# Altium schematic sheet KeyBoard-RP2040_P2.SchDoc
size A3; SheetNumber: 2; SheetTotal: 2
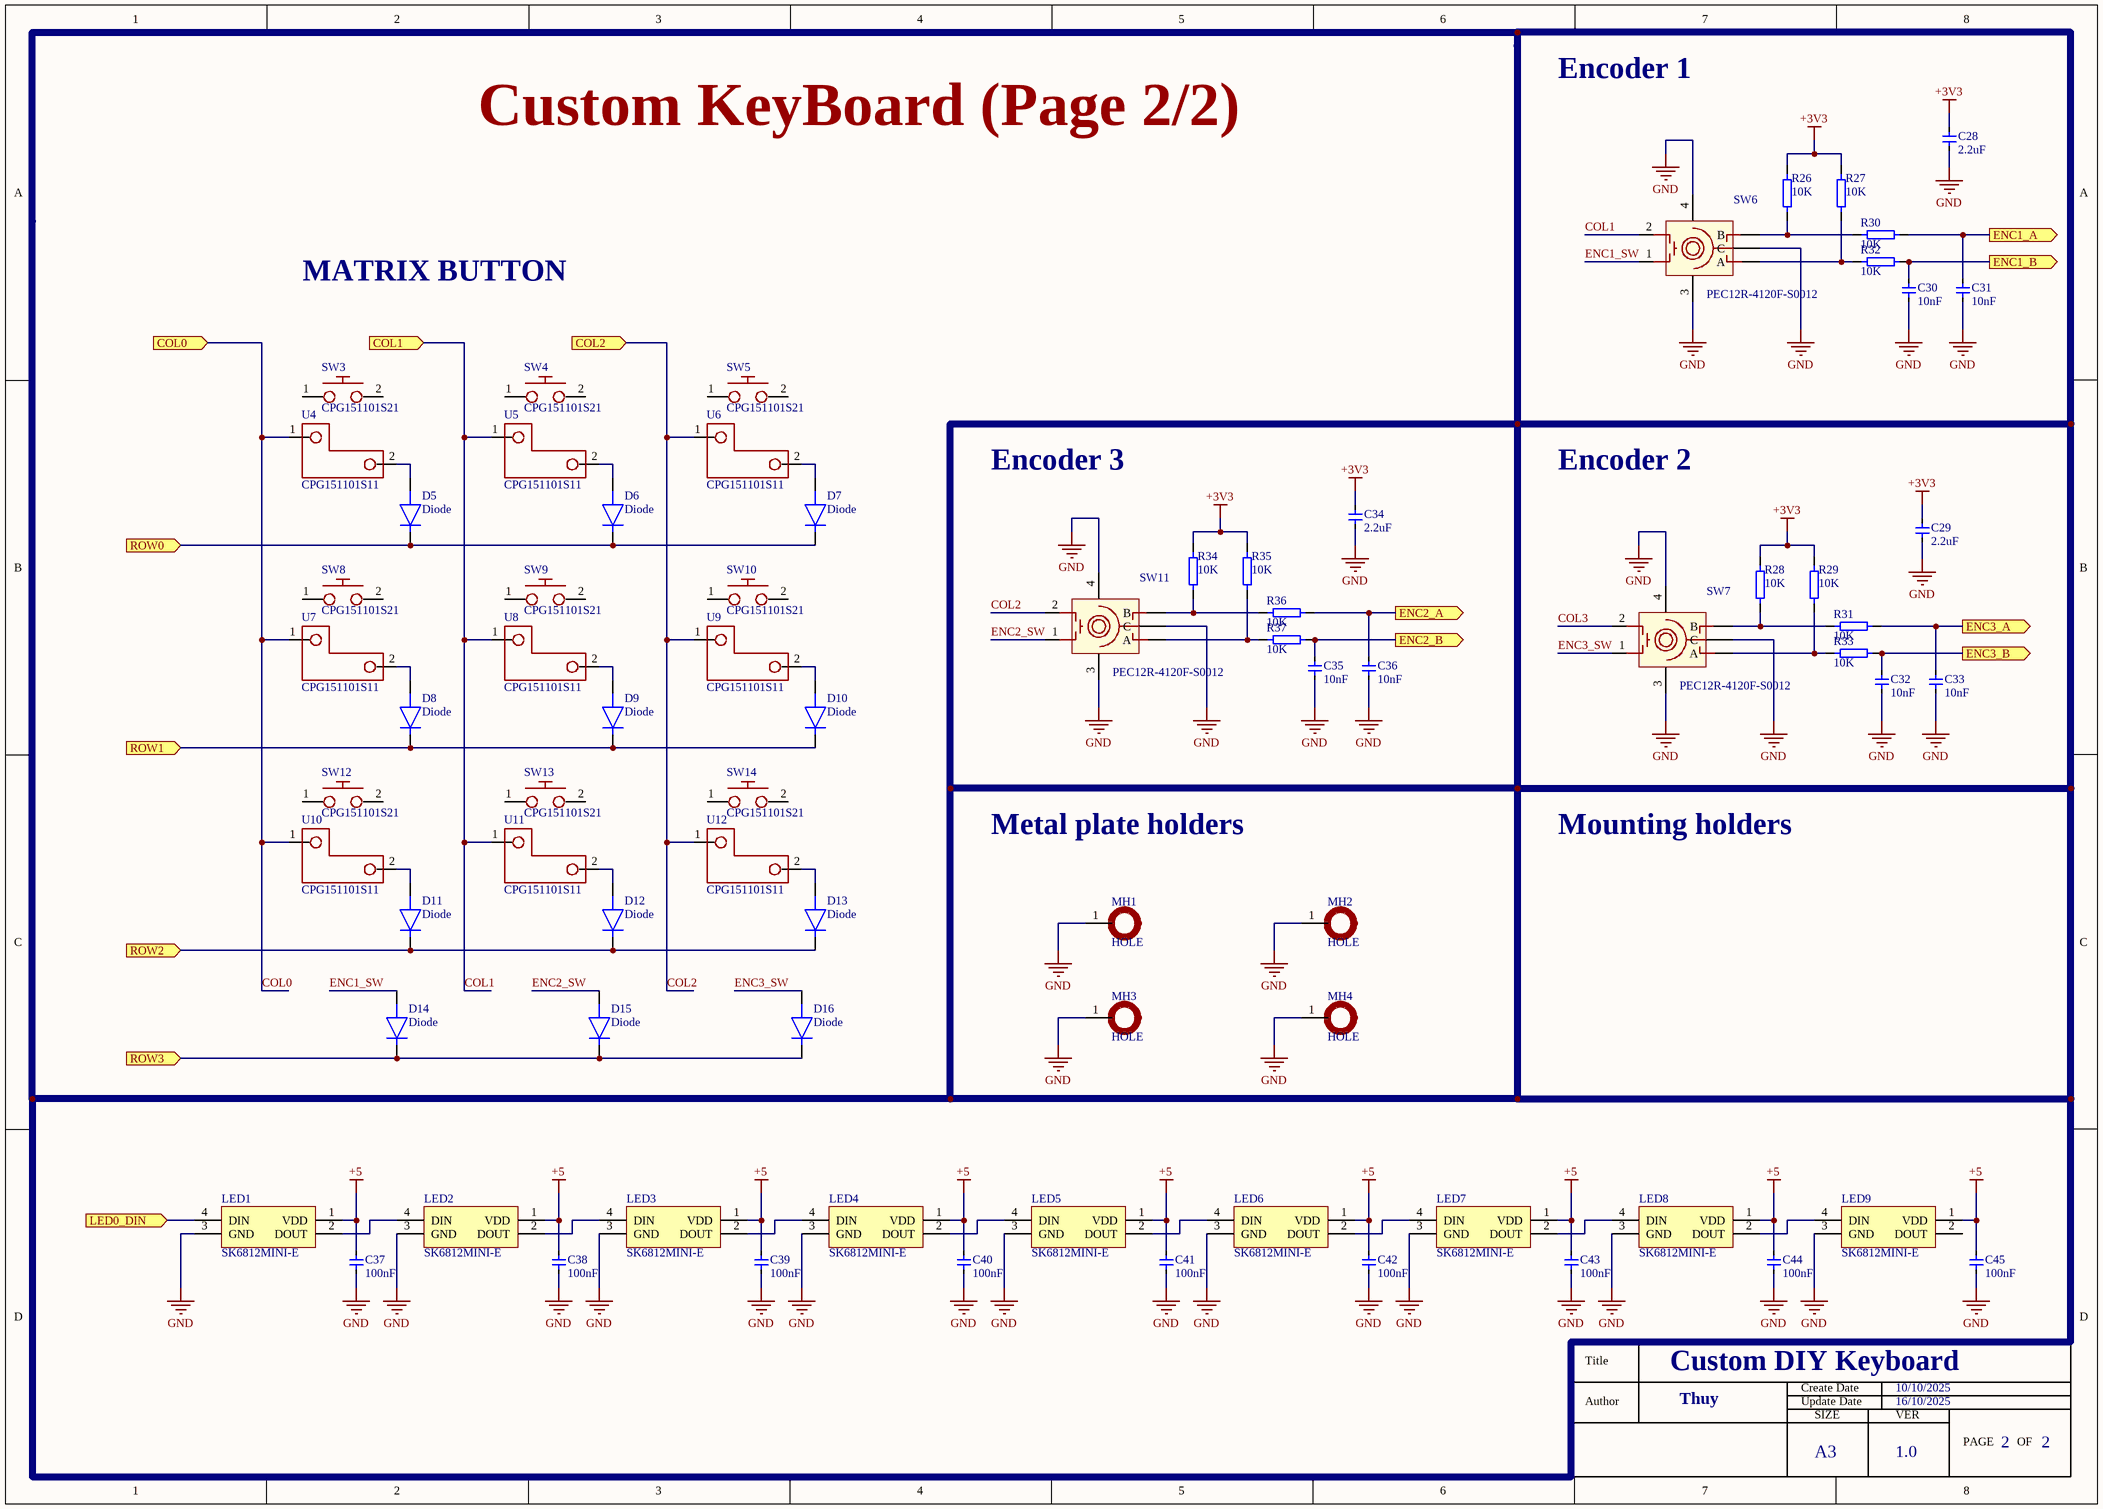
[diagram p0: KeyBoard-RP2040_P2.SchDoc]

## Parts
C28  2.2uF  [C 0.79 0.54]
C29  2.2uF  [C 0.79 0.54]
C30  10nF  [SMD 0.79 0.54]
C31  10nF  [SMD 0.79 0.54]
C32  10nF  [SMD 0.79 0.54]
C33  10nF  [SMD 0.79 0.54]
C34  2.2uF  [C 0.79 0.54]
C35  10nF  [SMD 0.79 0.54]
C36  10nF  [SMD 0.79 0.54]
C37  100nF  [C 0.79 0.54]
C38  100nF  [C 0.79 0.54]
C39  100nF  [C 0.79 0.54]
C40  100nF  [C 0.79 0.54]
C41  100nF  [C 0.79 0.54]
C42  100nF  [C 0.79 0.54]
C43  100nF  [C 0.79 0.54]
C44  100nF  [C 0.79 0.54]
C45  100nF  [C 0.79 0.54]
D5  Diode  [Diode]
D6  Diode  [Diode]
D7  Diode  [Diode]
D8  Diode  [Diode]
D9  Diode  [Diode]
D10  Diode  [Diode]
D11  Diode  [Diode]
D12  Diode  [Diode]
D13  Diode  [Diode]
D14  Diode  [Diode]
D15  Diode  [Diode]
D16  Diode  [Diode]
LED1  SK6812MINI-E  [LED-SK6812MINI-E]
LED2  SK6812MINI-E  [LED-SK6812MINI-E]
LED3  SK6812MINI-E  [LED-SK6812MINI-E]
LED4  SK6812MINI-E  [LED-SK6812MINI-E]
LED5  SK6812MINI-E  [LED-SK6812MINI-E]
LED6  SK6812MINI-E  [LED-SK6812MINI-E]
LED7  SK6812MINI-E  [LED-SK6812MINI-E]
LED8  SK6812MINI-E  [LED-SK6812MINI-E]
LED9  SK6812MINI-E  [LED-SK6812MINI-E]
MH1  HOLE  [Hole]
MH2  HOLE  [Hole]
MH3  HOLE  [Hole]
MH4  HOLE  [Hole]
R26  10K  [SMD 0.566 0.54]
R27  10K  [SMD 0.566 0.54]
R28  10K  [SMD 0.566 0.54]
R29  10K  [SMD 0.566 0.54]
R30  10K  [SMD 0.566 0.54]
R31  10K  [SMD 0.566 0.54]
R32  10K  [SMD 0.566 0.54]
R33  10K  [SMD 0.566 0.54]
R34  10K  [SMD 0.566 0.54]
R35  10K  [SMD 0.566 0.54]
R36  10K  [SMD 0.566 0.54]
R37  10K  [SMD 0.566 0.54]
SW3  CPG151101S21  [CPG151101S21]
SW4  CPG151101S21  [CPG151101S21]
SW5  CPG151101S21  [CPG151101S21]
SW6  PEC12R-4120F-S0012  [SW-encoder]
SW7  PEC12R-4120F-S0012  [SW-encoder]
SW8  CPG151101S21  [CPG151101S21]
SW9  CPG151101S21  [CPG151101S21]
SW10  CPG151101S21  [CPG151101S21]
SW11  PEC12R-4120F-S0012  [SW-encoder]
SW12  CPG151101S21  [CPG151101S21]
SW13  CPG151101S21  [CPG151101S21]
SW14  CPG151101S21  [CPG151101S21]
U4  CPG151101S11  [CPG151101S11]
U5  CPG151101S11  [CPG151101S11]
U6  CPG151101S11  [CPG151101S11]
U7  CPG151101S11  [CPG151101S11]
U8  CPG151101S11  [CPG151101S11]
U9  CPG151101S11  [CPG151101S11]
U10  CPG151101S11  [CPG151101S11]
U11  CPG151101S11  [CPG151101S11]
U12  CPG151101S11  [CPG151101S11]

## Ports
COL0 (in), COL1 (in), COL2 (in), ENC1_A (out), ENC1_B (out), ENC2_A (out), ENC2_B (out), ENC3_A (out), ENC3_B (out), LED0_DIN (in), ROW0 (in), ROW1 (in), ROW2 (in), ROW3 (in)

## Nets
+3V3: C28.2 C29.2 C34.2 R26.2 R27.2 R28.2 R29.2 R34.2 R35.2
+5: C37.2 C38.2 C39.2 C40.2 C41.2 C42.2 C43.2 C44.2 C45.2 LED1.1(VDD) LED2.1(VDD) LED3.1(VDD) LED4.1(VDD) LED5.1(VDD) LED6.1(VDD) LED7.1(VDD) LED8.1(VDD) LED9.1(VDD)
GND: C28.1 C29.1 C30.1 C31.1 C32.1 C33.1 C34.1 C35.1 C36.1 C37.1 C38.1 C39.1 C40.1 C41.1 C42.1 C43.1 C44.1 C45.1 LED1.3(GND) LED2.3(GND) LED3.3(GND) LED4.3(GND) LED5.3(GND) LED6.3(GND) LED7.3(GND) LED8.3(GND) LED9.3(GND) MH1.1 MH2.1 MH3.1 MH4.1 SW6.3 SW6.4 SW6.6(C) SW7.3 SW7.4 SW7.6(C) SW11.3 SW11.4 SW11.6(C)
COL0: U4.1 U7.1 U10.1 ; port COL0
COL1: SW6.2 U5.1 U8.1 U11.1 ; port COL1
COL2: SW11.2 U6.1 U9.1 U12.1 ; port COL2
COL3: SW7.2
ENC1_A: C31.2 R30.1 ; port ENC1_A
ENC1_B: C30.2 R32.1 ; port ENC1_B
ENC1_SW: D14.2 SW6.1
ENC2_A: C36.2 R36.1 ; port ENC2_A
ENC2_B: C35.2 R37.1 ; port ENC2_B
ENC2_SW: D15.2 SW11.1
ENC3_A: C33.2 R31.1 ; port ENC3_A
ENC3_B: C32.2 R33.1 ; port ENC3_B
ENC3_SW: D16.2 SW7.1
LED0_DIN: LED1.4(DIN) ; port LED0_DIN
ROW0: D5.1 D6.1 D7.1 ; port ROW0
ROW1: D8.1 D9.1 D10.1 ; port ROW1
ROW2: D11.1 D12.1 D13.1 ; port ROW2
ROW3: D14.1 D15.1 D16.1 ; port ROW3
NetD5_2: D5.2 U4.2
NetD6_2: D6.2 U5.2
NetD7_2: D7.2 U6.2
NetD8_2: D8.2 U7.2
NetD9_2: D9.2 U8.2
NetD10_2: D10.2 U9.2
NetD11_2: D11.2 U10.2
NetD12_2: D12.2 U11.2
NetD13_2: D13.2 U12.2
NetLED1_2: LED1.2(DOUT) LED2.4(DIN)
NetLED2_2: LED2.2(DOUT) LED3.4(DIN)
NetLED3_2: LED3.2(DOUT) LED4.4(DIN)
NetLED4_2: LED4.2(DOUT) LED5.4(DIN)
NetLED5_2: LED5.2(DOUT) LED6.4(DIN)
NetLED6_2: LED6.2(DOUT) LED7.4(DIN)
NetLED7_2: LED7.2(DOUT) LED8.4(DIN)
NetLED8_2: LED8.2(DOUT) LED9.4(DIN)
NetR26_1: R26.1 R30.2 SW6.7(B)
NetR27_1: R27.1 R32.2 SW6.5(A)
NetR28_1: R28.1 R31.2 SW7.7(B)
NetR29_1: R29.1 R33.2 SW7.5(A)
NetR34_1: R34.1 R36.2 SW11.7(B)
NetR35_1: R35.1 R37.2 SW11.5(A)

Not connected (* = marked no-connect by the designer): LED9 2(DOUT); SW3 1 2; SW4 1 2; SW5 1 2; SW8 1 2; SW9 1 2; SW10 1 2; SW12 1 2; SW13 1 2; SW14 1 2

## Notes on the sheet
- Encoder 1
- Custom KeyBoard (Page 2/2)
- MATRIX BUTTON
- Encoder 3
- Encoder 2
- Metal plate holders
- Mounting holders
- Custom DIY Keyboard
- 10/10/2025
- Thuy
- 1.0
- 16/10/2025
- 2
- Title
- Create Date
- Author
- Update Date
- SIZE
- A3
- VER
- PAGE
- OF

## Library data of the parts
C28 C29 C34 = CAP 2.2uF: SMD
C30-C33 C35 C36 = CAP 10nF: SMD
C37-C45 = CAP 100nF: SMD
D5-D16 = Diode: SMD
LED1-LED9 = LED-SK6812MINI-E: RGB 3.7V~5.5V 0.6mA
R26-R37 = RES 10K: SMD
SW3-SW5 SW8-SW10 SW12-SW14 = SW-CPG151101S21
SW6 SW7 SW11 = Encoder-PEC12R
U4-U12 = SW-CPG151101S11